# Altium schematic sheet mini驱动V2.SchDoc
size A4
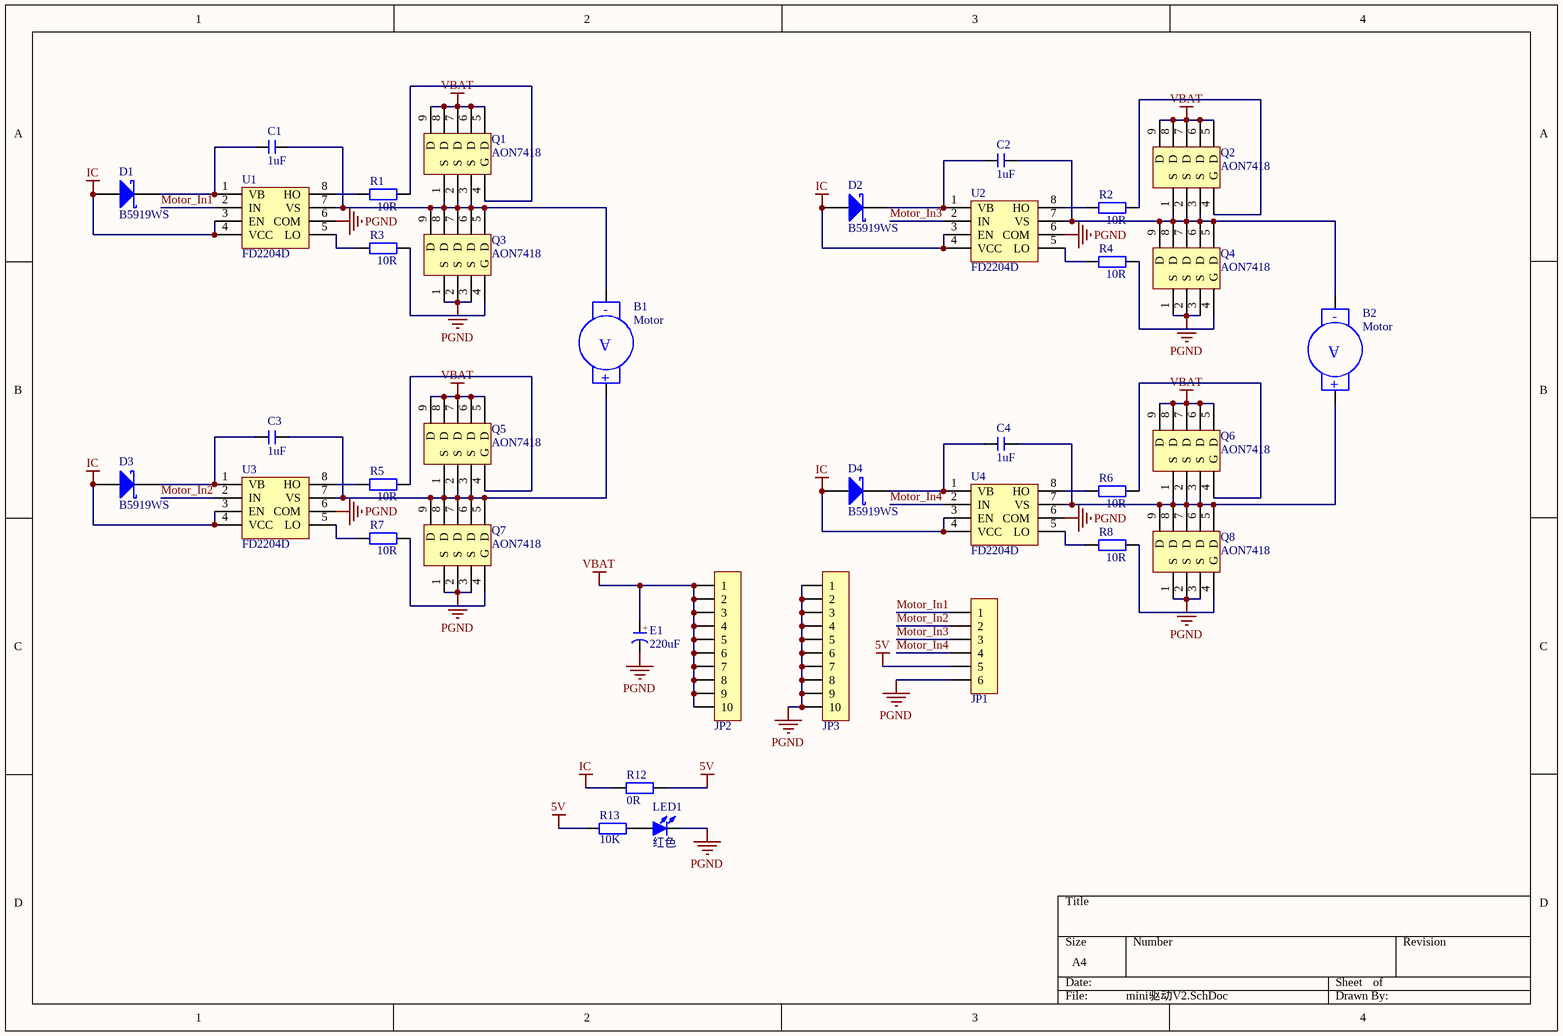
[diagram p0: mini驱动V2.SchDoc]

## Parts
B1  Motor  [电机]
B2  Motor  [电机]
C1  1uF  [C 0805_M]
C2  1uF  [C 0805_M]
C3  1uF  [C 0805_M]
C4  1uF  [C 0805_M]
D1  B5919WS  [SOD-323]
D2  B5919WS  [SOD-323]
D3  B5919WS  [SOD-323]
D4  B5919WS  [SOD-323]
E1  220uF  [CD D(7343)]
JP1  HDR-1X6  [HDR2.54-LI-6P]  (value not drawn)
JP2  HDR-1X10  [HDR2.54-LI-10P]  (value not drawn)
JP3  HDR-1X10  [HDR2.54-LI-10P]  (value not drawn)
LED1  红色  [LED 0805G]
Q1  AON7418  [AON7418]
Q2  AON7418  [AON7418]
Q3  AON7418  [AON7418]
Q4  AON7418  [AON7418]
Q5  AON7418  [AON7418]
Q6  AON7418  [AON7418]
Q7  AON7418  [AON7418]
Q8  AON7418  [AON7418]
R1  10R  [R 0805_M]
R2  10R  [R 0805_M]
R3  10R  [R 0805_M]
R4  10R  [R 0805_M]
R5  10R  [R 0805_M]
R6  10R  [R 0805_M]
R7  10R  [R 0805_M]
R8  10R  [R 0805_M]
R12  0R  [R 0805_L]
R13  10K  [R 0805_L]
U1  FD2204D  [FD2204D]
U2  FD2204D  [FD2204D]
U3  FD2204D  [FD2204D]
U4  FD2204D  [FD2204D]

## Nets
5V: JP1.5 R12.1 R13.1
IC: D1.1(A) D2.1(A) D3.1(A) D4.1(A) R12.2 U1.3(EN) U1.4(VCC) U2.3(EN) U2.4(VCC) U3.3(EN) U3.4(VCC) U4.3(EN) U4.4(VCC)
PGND: E1.2(K) JP1.6 JP3.1 JP3.2 JP3.3 JP3.4 JP3.5 JP3.6 JP3.7 JP3.8 JP3.9 JP3.10 LED1.2(K) Q3.1(S) Q3.2(S) Q3.3(S) Q4.1(S) Q4.2(S) Q4.3(S) Q7.1(S) Q7.2(S) Q7.3(S) Q8.1(S) Q8.2(S) Q8.3(S) U1.6(COM) U2.6(COM) U3.6(COM) U4.6(COM)
VBAT: E1.1(A) JP2.1 JP2.2 JP2.3 JP2.4 JP2.5 JP2.6 JP2.7 JP2.8 JP2.9 JP2.10 Q1.5(D) Q1.6(D) Q1.7(D) Q1.8(D) Q1.9(D) Q2.5(D) Q2.6(D) Q2.7(D) Q2.8(D) Q2.9(D) Q5.5(D) Q5.6(D) Q5.7(D) Q5.8(D) Q5.9(D) Q6.5(D) Q6.6(D) Q6.7(D) Q6.8(D) Q6.9(D)
Motor_In1: JP1.1 U1.2(IN)
Motor_In2: JP1.2 U3.2(IN)
Motor_In3: JP1.3 U2.2(IN)
Motor_In4: JP1.4 U4.2(IN)
NetB1_1: B1.1(+) C3.1 Q5.1(S) Q5.2(S) Q5.3(S) Q7.5(D) Q7.6(D) Q7.7(D) Q7.8(D) Q7.9(D) U3.7(VS)
NetB1_2: B1.2(-) C1.1 Q1.1(S) Q1.2(S) Q1.3(S) Q3.5(D) Q3.6(D) Q3.7(D) Q3.8(D) Q3.9(D) U1.7(VS)
NetB2_1: B2.1(+) C4.1 Q6.1(S) Q6.2(S) Q6.3(S) Q8.5(D) Q8.6(D) Q8.7(D) Q8.8(D) Q8.9(D) U4.7(VS)
NetB2_2: B2.2(-) C2.1 Q2.1(S) Q2.2(S) Q2.3(S) Q4.5(D) Q4.6(D) Q4.7(D) Q4.8(D) Q4.9(D) U2.7(VS)
NetC1_2: C1.2 D1.2(K) U1.1(VB)
NetC2_2: C2.2 D2.2(K) U2.1(VB)
NetC3_2: C3.2 D3.2(K) U3.1(VB)
NetC4_2: C4.2 D4.2(K) U4.1(VB)
NetLED1_1: LED1.1(A) R13.2
NetQ1_4: Q1.4(G) R1.1
NetQ2_4: Q2.4(G) R2.1
NetQ3_4: Q3.4(G) R3.1
NetQ4_4: Q4.4(G) R4.1
NetQ5_4: Q5.4(G) R5.1
NetQ6_4: Q6.4(G) R6.1
NetQ7_4: Q7.4(G) R7.1
NetQ8_4: Q8.4(G) R8.1
NetR1_2: R1.2 U1.8(HO)
NetR2_2: R2.2 U2.8(HO)
NetR3_2: R3.2 U1.5(LO)
NetR4_2: R4.2 U2.5(LO)
NetR5_2: R5.2 U3.8(HO)
NetR6_2: R6.2 U4.8(HO)
NetR7_2: R7.2 U3.5(LO)
NetR8_2: R8.2 U4.5(LO)

## Notes on the sheet
- (in symbol CT) +
- (in symbol Motor Servo) A

## Library data of the parts
B1 B2 = Motor Servo: Servo Motor
C1-C4 = C: 贴片电容; BOM名称: 无极性贴片电容; 淘宝ID: 封装库来自淘宝 ID：黄晶宝石; 联系售后: https://shop463601444.taobao.com
D1-D4 = 1N5819: 肖特基二极管; 淘宝ID: 封装库来自淘宝 ID：黄晶宝石; 属性: 40V/2A; BOM名称: 肖特基二极管; 欢迎光临: https://shop463601444.taobao.com
E1 = CT: 贴片钽电容; 淘宝ID: 封装库来自淘宝 ID：黄晶宝石; BOM名称: 贴片钽电容; 联系售后: https://shop463601444.taobao.com
JP1 = Header 6: 6P接插件; 版权归属: 封装库来自淘宝 ID：黄晶宝石; BOM名称: 6P接插件; 学习资源: https://shop463601444.taobao.com
JP2 JP3 = Header 10: 10P接插件; 版权归属: 源创客; BOM名称: 10P接插件; 学习资源: www.ooocke.com
LED1 = LED-SMD: 贴片LED; 版权归属: 封装库来自淘宝 ID：黄晶宝石; BOM名称: 贴片LED; 学习资源: https://shop463601444.taobao.com
R1-R8 R12 R13 = RES